# EAGLE design Four-Buttons (EAGLE 9.6.2)
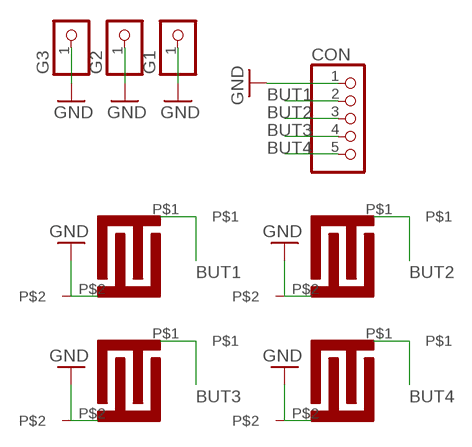
[diagram p0: schematic, sheet 1]

## Parts
BTN1  BTN_1  [BTN_1]
BTN2  BTN_1  [BTN_1]
BTN3  BTN_1  [BTN_1]
BTN4  BTN_1  [BTN_1]
CON  PINHD-1X5  [1X05]
G1  PINHD-1X1  [1X01]
G2  PINHD-1X1  [1X01]
G3  PINHD-1X1  [1X01]

## Nets
BUT1: BTN1.P$1 CON.2
BUT2: BTN2.P$1 CON.3
BUT3: BTN3.P$1 CON.4
BUT4: BTN4.P$1 CON.5
GND: BTN1.P$2 BTN2.P$2 BTN3.P$2 BTN4.P$2 CON.1 G1.1 G2.1 G3.1

## Library data of the parts
BTN1-BTN4 = surfacebuttons:BTN_1
CON = pinhead:PINHD-1X5: PIN HEADER
G1-G3 = pinhead:PINHD-1X1: PIN HEADER

## Board
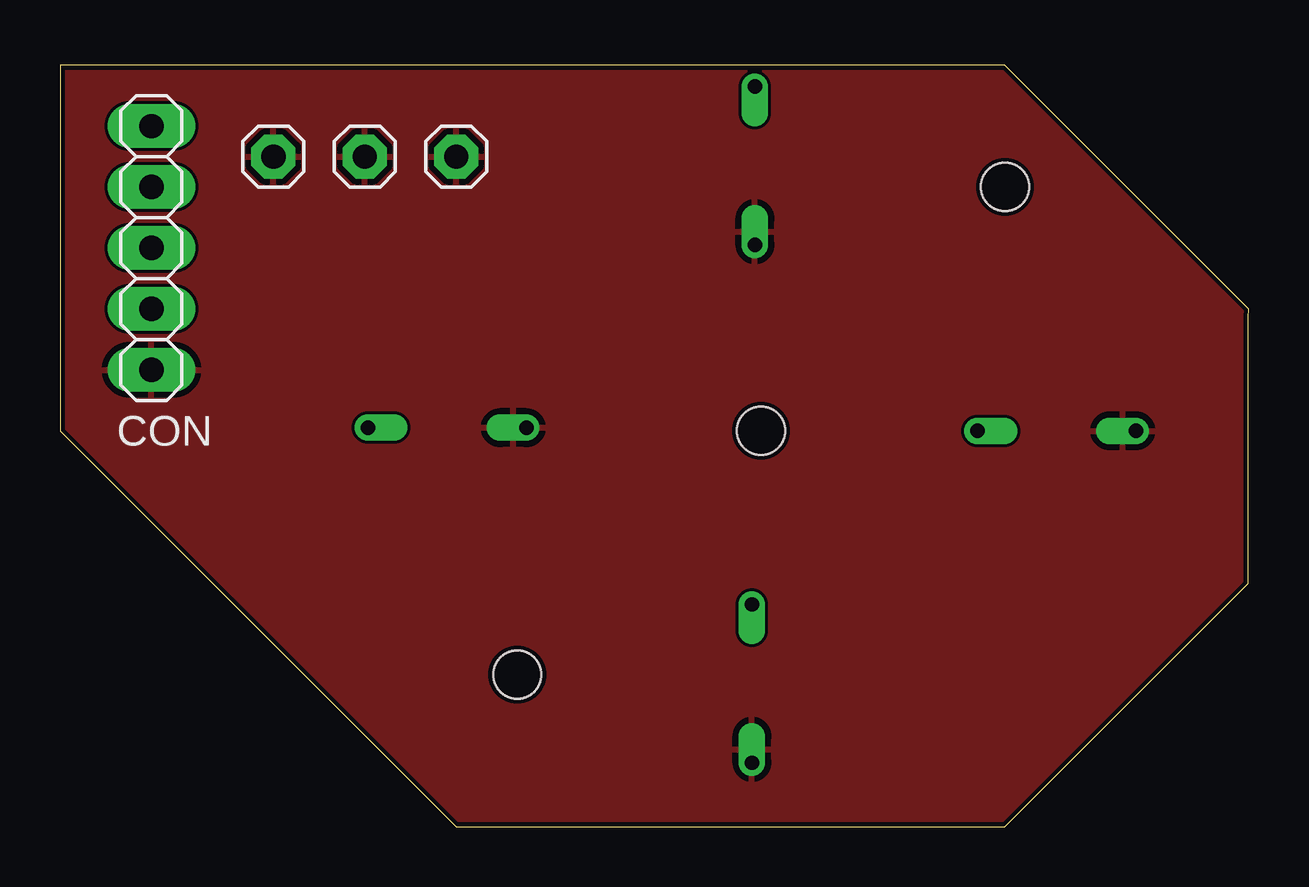
[diagram p1: board, top side]
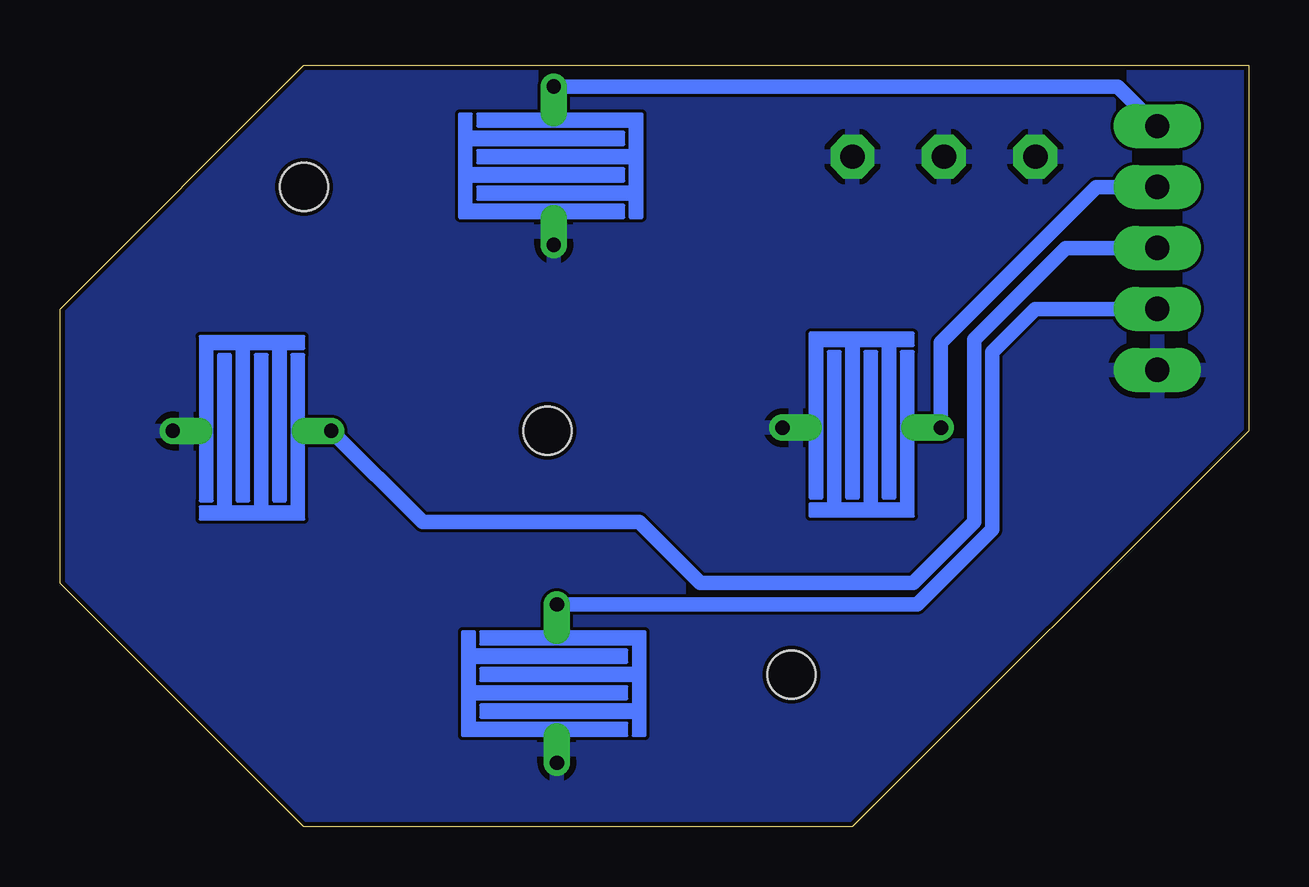
[diagram p2: board, bottom side, seen from below]

Size 49.53 x 31.75 mm. Coordinates in mm from the lower left corner, seen from the top.
Outline: 0,16.51 16.51,0 39.37,0 49.51,10.14 49.51,21.26 49.53,21.59 39.37,31.75 0,31.75 0,16.51
Copper layers (1*16): Top 0.035mm / dielectric 1.6mm / Bottom 0.035mm
Design rules "jlcpcb-2layers": minimum track width 5mil, minimum drill 0.3mm, track to track 5mil, track to pad 5mil, pad to pad 5mil, via to via 5mil, smd to smd 5mil, copper to edge 0.2mm, drill to drill 6mil, minimum pad ring 10mil, minimum via ring 3mil, stop-mask expansion 4mil, vias tented up to drill 0mil, thermal gap 10mil
Holes 2 mm at 19.05,6.35 39.37,26.67 29.21,16.51

### Footprints (pad centres in the part's own frame; a part is rotated, then mirrored left to right if it is on the bottom)
BTN_1 = drill 0.6 offset: P$1 -3.175,-0.127; P$2 3.429,-0.127
1X05 = drill 1.016 long: 1 -5.08,0; 2 -2.54,0; 3 0,0; 4 2.54,0; 5 5.08,0
1X01 = drill 1.016 octagon: 1 0,0

### Placement (x,y rotation side)
BTN1  28.96,6.1 270 top
BTN2  41.4,16.64 0 top
BTN3  16,16.76 0 top
BTN4  29.08,27.69 270 top
CON  3.81,24.13 90 top
G1  16.51,27.94 0 top
G2  8.89,27.94 0 top
G3  12.7,27.94 0 top

### Tracks (layer width: path | path; a pad name or v marks a point on that pad's centre or on a via)
BUT1
  Bottom 0.61: CON.2 8.89,21.59 10.69,19.79 10.69,12.39 13.82,9.27 BTN1.P$1
BUT2
  Bottom 0.61: CON.3 7.62,24.13 11.43,20.32 11.43,12.7 13.97,10.16 22.86,10.16 25.4,12.7 34.42,12.7 BTN2.P$1
BUT3
  Bottom 0.61: CON.4 6.35,26.67 12.83,20.19 BTN3.P$1
BUT4
  Bottom 0.61: CON.5 5.46,30.86 BTN4.P$1
GND
  pour Top: -1.27,33.02 -1.27,-1.27 49.53,-1.27 49.53,33.02
  pour Bottom: -1.27,31.75 -1.27,-1.27 52.07,-1.27 52.07,33.02 -1.27,33.02